# Altium schematic sheet design_3.SchDoc: design
size 414 x 279 mm; Date: 1/25/2021 11:39:22 PM; SheetNumber: 4; Origin: Eagle; GateName_1: G$1; SymbolName_1: A3-L-GUMSTIX; LibraryName: qualified_1; DeviceSetName: A3-L-GUMSTIX; A: A; B: B; C: C; D: D; E: E; F: F; G: G; H: H; 1: 1; 2: 2; 3: 3; 4: 4; 5: 5; Sheet: Sheet:; C:/Gumstix/gumstix-logo-16.bmp: C:/Gumstix/gumstix-logo-16.bmp; Board: Board:
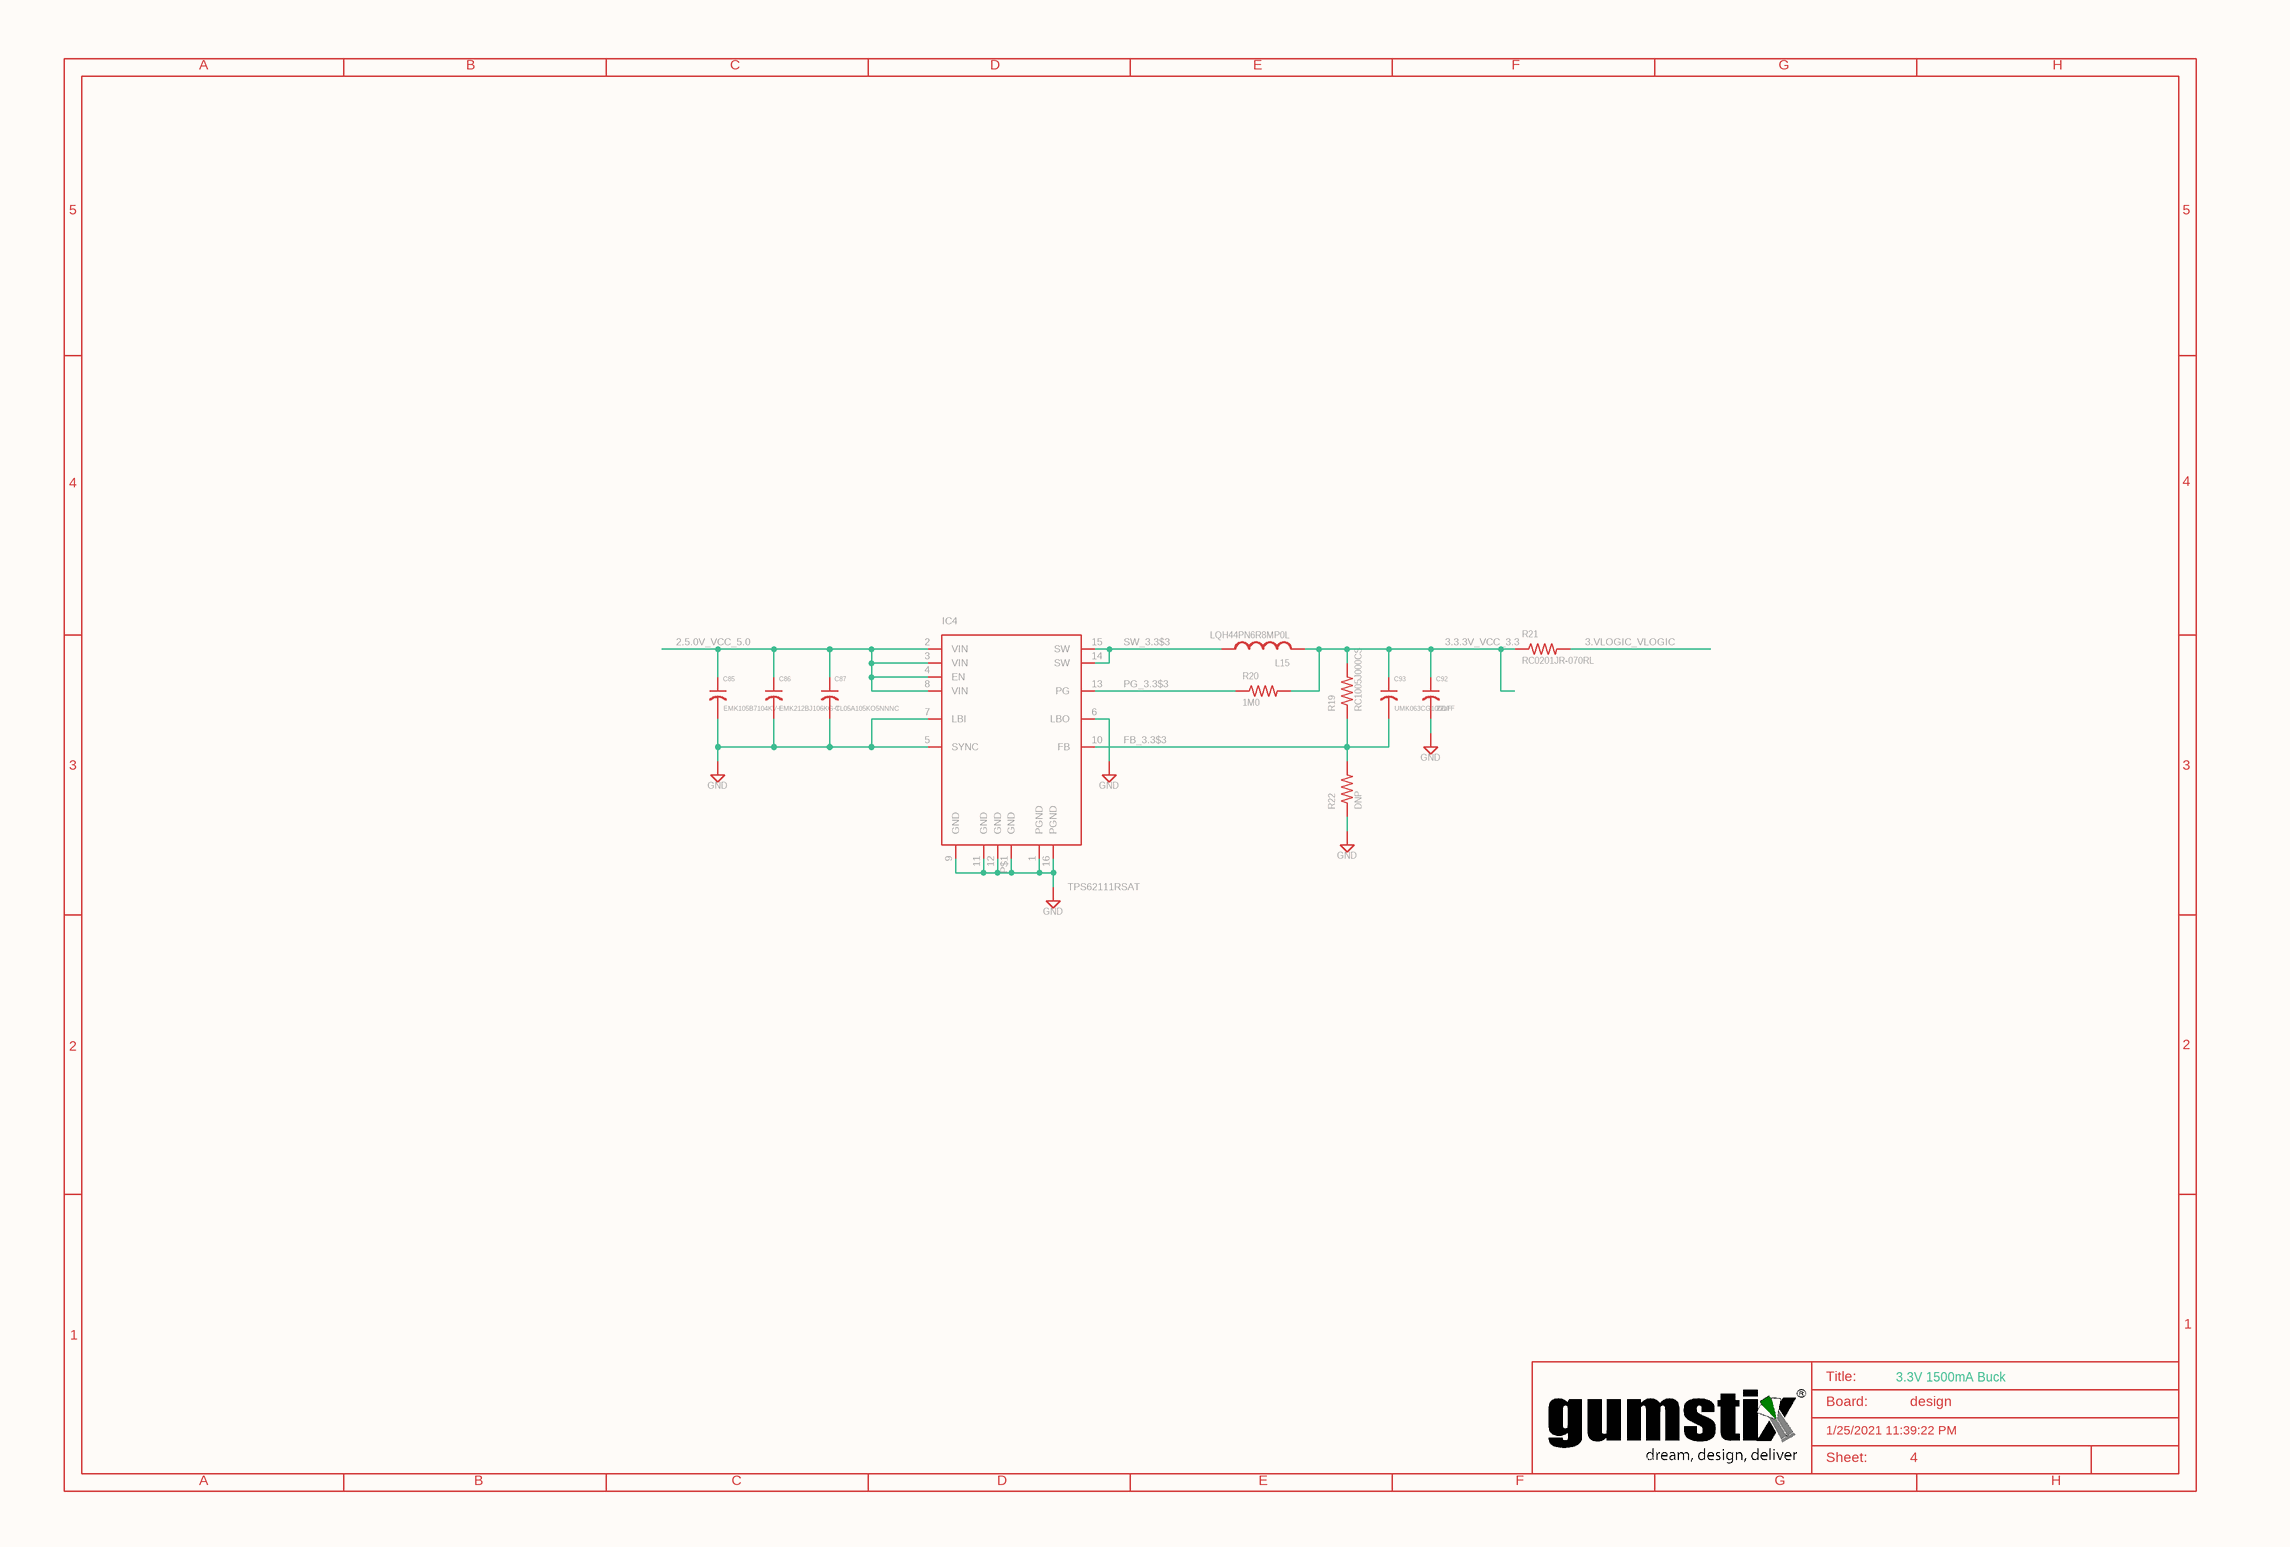
[diagram p0: design_3.SchDoc]

## Parts
C85  EMK105B7104KV-F  [0402]
C86  EMK212BJ106KG-T  [0805]
C87  CL05A105KO5NNNC  [0402]
C92  22uF  [0805]
C93  UMK063CG100DTF  [0201]
IC4  TPS62111RSAT  [PQFP16]
L15  LQH44PN6R8MP0L  [1515]
R19  RC1005J000CS  [0402]
R20  1M0  [0201]
R21  RC0201JR-070RL  [0201]
R22  DNP  [0402]
SUPPLY88  GND
SUPPLY97  GND
SUPPLY98  GND
SUPPLY116  GND
SUPPLY117  GND

## Nets
2.5.0V_VCC_5.0: C85.1 C86.1 C87.1 IC4.2(VIN) IC4.3(VIN) IC4.4(EN) IC4.8(VIN)
3.3.3V_VCC_3.3: C92.1 C93.1 L15.2 R19.2 R20.2 R21.1
3.VLOGIC_VLOGIC: R21.2
FB_3.3$3: C93.2 IC4.10(FB) R19.1 R22.2
PG_3.3$3: IC4.13(PG) R20.1
SW_3.3$3: IC4.14(SW) IC4.15(SW) L15.1
NetC85_2: C85.2 C86.2 C87.2 IC4.5(SYNC) IC4.7(LBI) SUPPLY88.?1(GND)
NetC92_2: C92.2 SUPPLY98.?1(GND)
NetIC4_1: IC4.1(PGND) IC4.9(GND) IC4.11(GND) IC4.12(GND) IC4.16(PGND) IC4.P$1(GND) SUPPLY116.?1(GND)
NetIC4_6: IC4.6(LBO) SUPPLY117.?1(GND)
NetR22_1: R22.1 SUPPLY97.?1(GND)

## Notes on the sheet
- A
- B
- C
- D
- E
- F
- G
- H
- 5
- 4
- 3
- 2
- 1
- Title:
- Board:
- 3.3V 1500mA Buck
- design
- C:/Gumstix/gumstix-logo-16.bmp
- 1/25/2021 11:39:22 PM
- Sheet:

## Library data of the parts
C85 = EMK105B7104KV-F: GateName_1: G$1; SymbolName_1: C-US; LibraryName: qualified_1@eagle_src_repo_825e5973c79738778b249d35b895f4444d985c7a; DeviceSetName: EMK105B7104KV-F; DM: DM; DR: DR; DX: DX; DY: DY; HEIGHT: 0.35; SHEETNO: SHEETNO
C86 = EMK212BJ106KG-T: GateName_1: G$1; SymbolName_1: C-US; LibraryName: qualified_1@eagle_src_repo_825e5973c79738778b249d35b895f4444d985c7a; DeviceSetName: EMK212BJ106KG-T; DM: DM; DR: DR; DX: DX; DY: DY; HEIGHT: 0.51; SHEETNO: SHEETNO
C87 = CL05A105KO5NNNC: GateName_1: G$1; SymbolName_1: C-US; LibraryName: qualified_1@eagle_src_repo_825e5973c79738778b249d35b895f4444d985c7a; DeviceSetName: CL05A105KO5NNNC; HEIGHT: 0.35
C92 = C0805: GateName_1: G$1; SymbolName_1: C-US; DeviceSetName: C; DeviceName: 0805; LibraryName: qualified_1@eagle_src_repo_825e5973c79738778b249d35b895f4444d985c7a; DM: DM; DR: DR; DX: DX; DY: DY; HEIGHT: 0.51; SHEETNO: SHEETNO
C93 = UMK063CG100DTF: GateName_1: G$1; SymbolName_1: C-US; LibraryName: qualified_1@eagle_src_repo_825e5973c79738778b249d35b895f4444d985c7a; DeviceSetName: UMK063CG100DTF; HEIGHT: 0.25
IC4 = TPS62111RSAT: GateName_1: G$1; SymbolName_1: TPS62111; LibraryName: qualified_1; DeviceSetName: TPS62111RSAT; DM: DM; DR: DR; DX: DX; DY: DY; HEIGHT: 1; SHEETNO: SHEETNO
L15 = LQH44PN6R8MP0L: GateName_1: G$1; SymbolName_1: L-US; LibraryName: qualified_1@eagle_src_repo_825e5973c79738778b249d35b895f4444d985c7a; DeviceSetName: LQH44PN6R8MP0L; HEIGHT: 1.9
R19 = RC1005J000CS: GateName_1: G$1; SymbolName_1: R-US; LibraryName: qualified_1@eagle_src_repo_825e5973c79738778b249d35b895f4444d985c7a; DeviceSetName: RC1005J000CS; DM: DM; DR: DR; DX: DX; DY: DY; HEIGHT: 0.35; SHEETNO: SHEETNO
R20 = R0201: GateName_1: G$1; SymbolName_1: R-US; DeviceSetName: R; DeviceName: 0201; LibraryName: qualified_1@eagle_src_repo_825e5973c79738778b249d35b895f4444d985c7a; HEIGHT: 0.25
R21 = RC0201JR-070RL: GateName_1: G$1; SymbolName_1: R-US; LibraryName: qualified_1@eagle_src_repo_825e5973c79738778b249d35b895f4444d985c7a; DeviceSetName: RC0201JR-070RL; HEIGHT: 0.25
R22 = R0402: GateName_1: G$1; SymbolName_1: R-US; DeviceSetName: R; DeviceName: 0402; LibraryName: qualified_1@eagle_src_repo_825e5973c79738778b249d35b895f4444d985c7a; DM: DM; DR: DR; DX: DX; DY: DY; HEIGHT: 0.35; SHEETNO: SHEETNO
SUPPLY88 SUPPLY97 SUPPLY98 SUPPLY116 SUPPLY117 = GND: SUPPLY SYMBOL; SymbolName_1: GND-2; GateName_1: GND; LibraryName: qualified_1; DeviceSetName: GND